# EAGLE design TelTail Lights EP 2v1 (EAGLE 9.6.2)
Assembly variants: PCBA
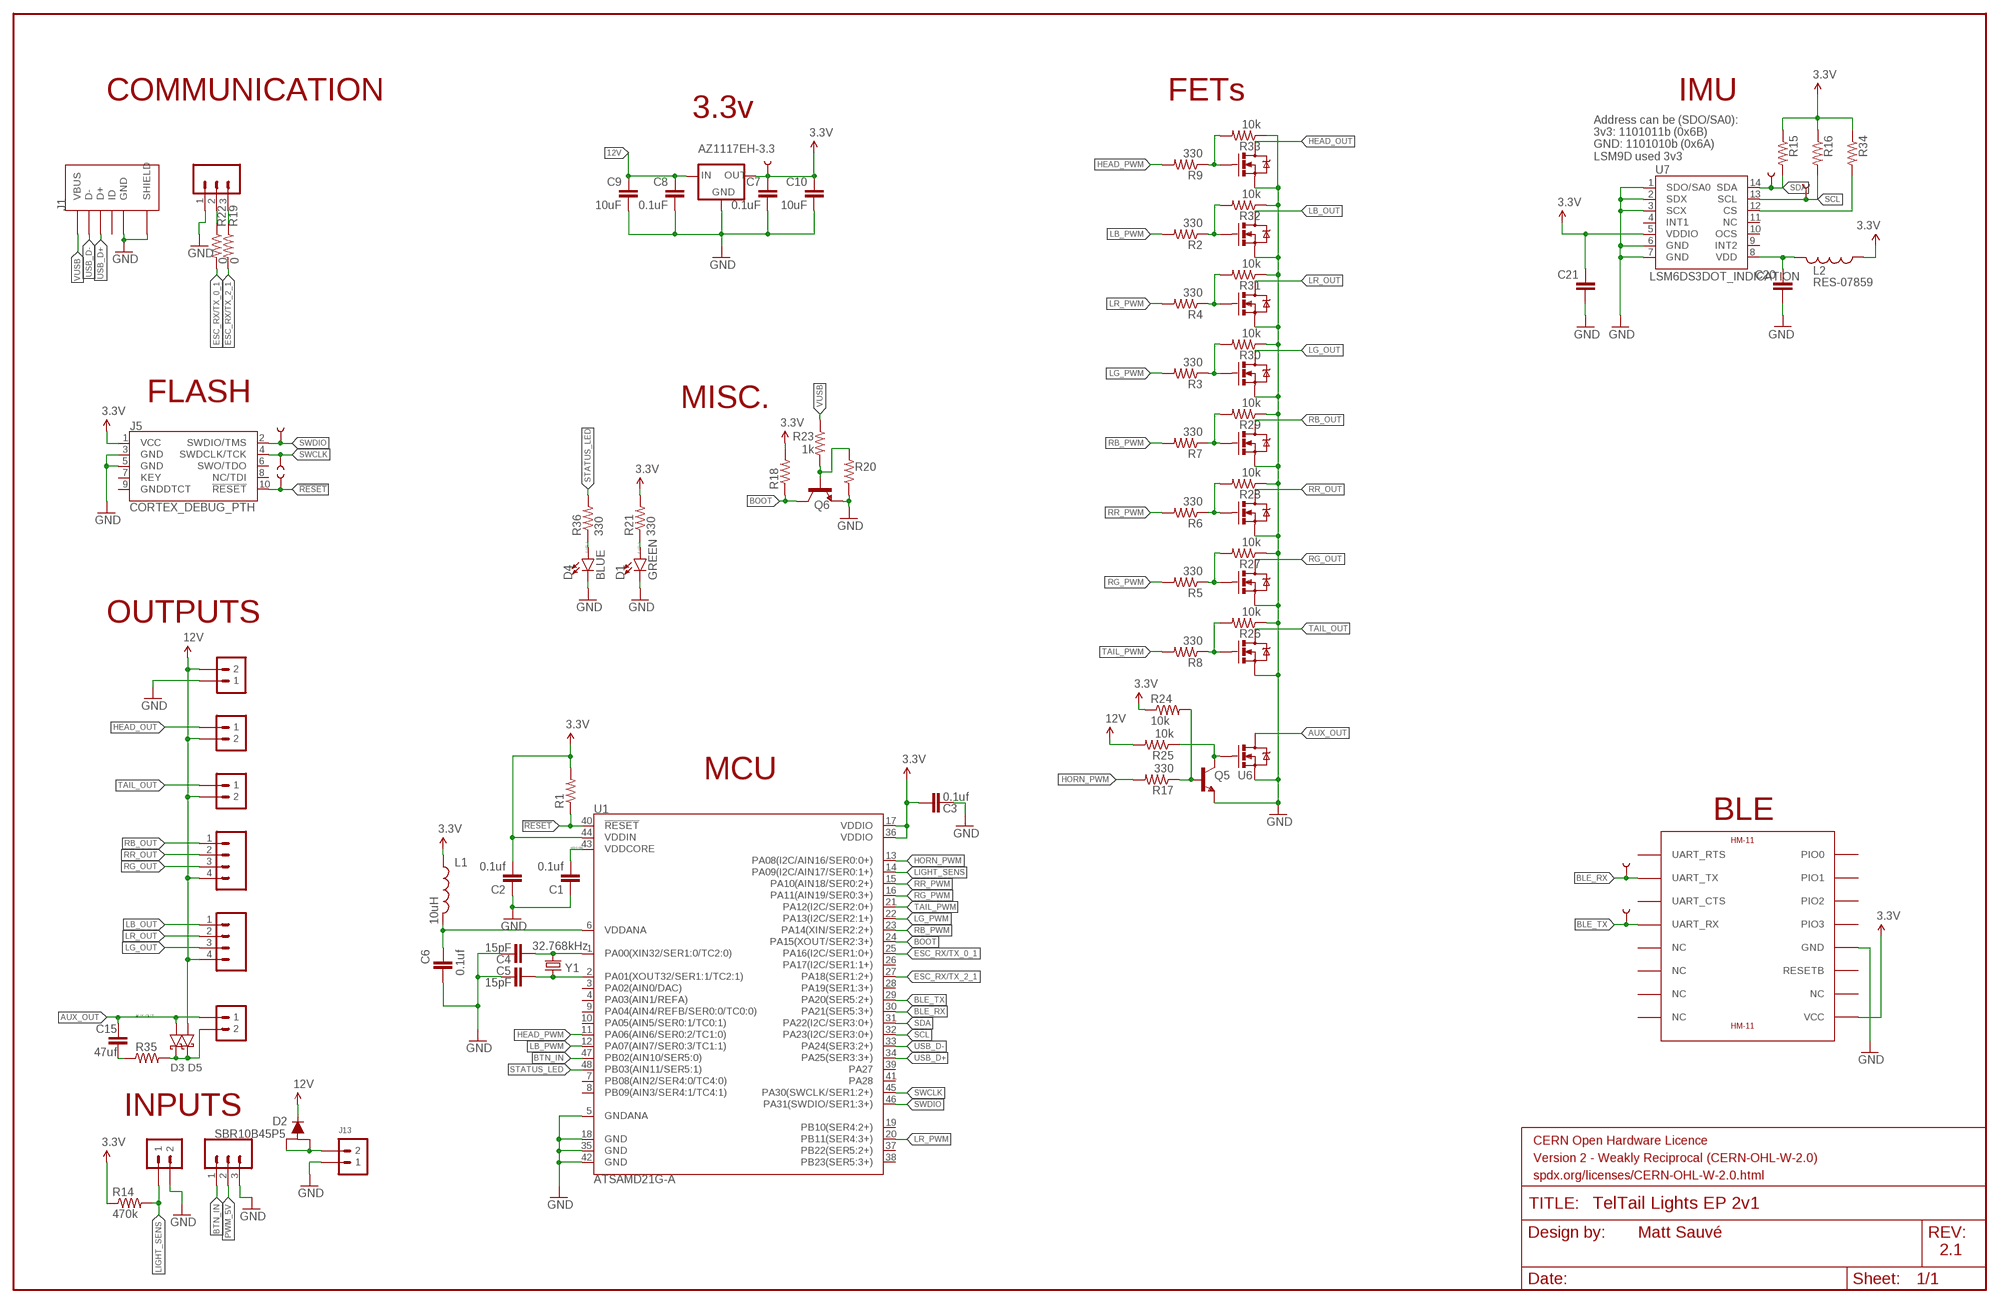
[diagram p0: schematic, sheet 1]

## Parts
C1  0.1uf  CAP0603-CAP  [0603-CAP]
C2  0.1uf  CAP0603-CAP  [0603-CAP]
C3  0.1uf  CAP0603-CAP  [0603-CAP]
C4  15pF  CAP0603-CAP  [0603-CAP]
C5  15pF  CAP0603-CAP  [0603-CAP]
C6  0.1uf  CAP0603-CAP  [0603-CAP]
C7  0.1uF  CAP0603-CAP  [0603-CAP]
C8  0.1uF  CAP0603-CAP  [0603-CAP]
C9  10uF  CAP0603-CAP  [0603-CAP]
C10  10uF  CAP0603-CAP  [0603-CAP]
C15  47uf  CAP1210  [1210-CAP]
C20  0.1uF  CAP0603-CAP  [0603-CAP]
C21  0.1uF  CAP0603-CAP  [0603-CAP]
D1  GREEN  LED0603  [LED-0603-2]
D2  SBR10B45P5  [POWERDI5]
D3  PMEG2010ER  [SOD-123W]
D4  BLUE  LED0603  [LED-0603-2]
D5  PMEG2010ER  [SOD-123W]
FRAME1  FRAME-LEDGER_CERN_WEAK  [CERN_WEAK]
J1  USB3160-XX-XXXX-X-X_REVA  [GCT_USB3160-XX-XXXX-X-X_REVA]
J3  JST_PH_3POS  [JST_PH_3POS]  (not fitted in variant PCBA)
J4  JST_PH_2POS  [JST_PH_2POS]  (not fitted in variant PCBA)
J5  CORTEX_DEBUG_PTH  [2X5-PTH-1.27MM-2]  (not fitted in variant PCBA)
J6  JST_PH_2POS  [JST_PH_2POS]  (not fitted in variant PCBA)
J7  JST_PH_2POS  [JST_PH_2POS]  (not fitted in variant PCBA)
J8  JST_PH_4POS  [JST_PH_4POS]  (not fitted in variant PCBA)
J9  JST_PH_4POS  [JST_PH_4POS]  (not fitted in variant PCBA)
J10  JST_PH_2POS  [JST_PH_2POS]  (not fitted in variant PCBA)
J11  JST_PH_2POS  [JST_PH_2POS]  (not fitted in variant PCBA)
J12  JST_PH_3POS  [JST_PH_3POS]  (not fitted in variant PCBA)
J13  TERM_BLOCK_SPRING_2POS_5MM  [TERM_BLOCK_SPRING_2POS_5MM]  (not fitted in variant PCBA)
L1  10uH  INDUCTOR0603  [0603-IND]
L2  RES-07859  INDUCTOR0603  [0603-IND]
Q1  DUAL_NFET_3.5A  [TSOT26]
Q2  DUAL_NFET_3.5A  [TSOT26]
Q3  DUAL_NFET_3.5A  [TSOT26]
Q4  DUAL_NFET_3.5A  [TSOT26]
Q5  500mA/300V  TRANS_NPN-MMBTA42  [SOT23-3]
Q6  500mA/300V  TRANS_NPN-MMBTA42  [SOT23-3]
R1  10k  RES-0402  [RES-0402]
R2  330  RES-0402  [RES-0402]
R3  330  RES-0402  [RES-0402]
R4  330  RES-0402  [RES-0402]
R5  330  RES-0402  [RES-0402]
R6  330  RES-0402  [RES-0402]
R7  330  RES-0402  [RES-0402]
R8  330  RES-0402  [RES-0402]
R9  330  RES-0402  [RES-0402]
R14  470k  RES-0603  [RES-0603]
R15  10k  RES-0402  [RES-0402]
R16  10k  RES-0402  [RES-0402]
R17  330  RES-0402  [RES-0402]
R18  10k  RES-0402  [RES-0402]
R19  0  RES-0603  [RES-0603]
R20  10k  RES-0402  [RES-0402]
R21  330  RES-0402  [RES-0402]
R22  0  RES-0603  [RES-0603]
R23  1k  RES-0402  [RES-0402]
R24  10k  RES-0402  [RES-0402]
R25  10k  RES-0402  [RES-0402]
R26  10k  RES-0402  [RES-0402]
R27  10k  RES-0402  [RES-0402]
R28  10k  RES-0402  [RES-0402]
R29  10k  RES-0402  [RES-0402]
R30  10k  RES-0402  [RES-0402]
R31  10k  RES-0402  [RES-0402]
R32  10k  RES-0402  [RES-0402]
R33  10k  RES-0402  [RES-0402]
R34  10k  RES-0402  [RES-0402]
R35  100  RESISTOR0805  [0805-RES]
R36  330  RES-0402  [RES-0402]
TP1  1MM_TP  [1MM_TP]  (not fitted in variant PCBA)
TP2  1MM_TP  [1MM_TP]  (not fitted in variant PCBA)
TP3  1MM_TP  [1MM_TP]
TP4  1MM_TP  [1MM_TP]  (not fitted in variant PCBA)
TP5  1MM_TP  [1MM_TP]  (not fitted in variant PCBA)
TP8  1MM_TP  [1MM_TP]  (not fitted in variant PCBA)
TP9  1MM_TP  [1MM_TP]  (not fitted in variant PCBA)
TP10  1MM_TP  [1MM_TP]  (not fitted in variant PCBA)
U1  ATSAMD21G-A  [TQFP-48]
U3  HM-11  [HM-11]  (not fitted in variant PCBA)
U4  AZ1117EH-3.3  [SOT-223]
U6  PSMN8R5-60YS  [SOT669]
U7  LSM6DS3DOT_INDICATION  [LGA14L_DOT_INDICATOR]
Y1  32.768kHz  CRYSTAL-32.768KHZSMD-3.2X1.5  [CRYSTAL-SMD-3.2X1.5MM]

## Nets
3.3V: C2.2 C3.2 C7.1 C10.1 C21.1 J5.1(VCC) L1.1 L2.1 R1.2 R14.1 R15.1 R16.1 R18.2 R21.2 R24.1 R34.1 TP3.P$1 U1.17(VDDIO) U1.36(VDDIO) U1.44(VDDIN) U3.VCC U4.2(OUT) U4.4(OUT) U7.5(VDDIO)
12V: C8.1 C9.1 D2.CATHODE(C) D5.2(ANODE) J4.2 J6.2 J7.2 J8.4 J9.4 R25.2 U4.3(IN)
!RESET: J5.10(!RESET) R1.1 TP10.P$1 U1.40(!RESET!)
AUX_OUT: C15.1 D3.2(ANODE) J10.1 U6.P$1(D) U6.P$2(D)
BLE_RX: TP2.P$1 U1.30(PA21(SER5:3+)) U3.UART_TX
BLE_TX: TP1.P$1 U1.29(PA20(SER5:2+)) U3.UART_RX
BOOT: Q6.3(C) R18.1 U1.24(PA15(XOUT/SER2:3+))
BTN_IN: J12.1 U1.47(PB02(AIN10/SER5:0))
ESC_RX/TX_0_0: J3.2 R22.1
ESC_RX/TX_0_1: R22.2 U1.25(PA16(I2C/SER1:0+))
ESC_RX/TX_2_0: J3.3 R19.1
ESC_RX/TX_2_1: R19.2 U1.27(PA18(SER1:2+))
GND: C1.1 C2.1 C3.1 C4.2 C5.2 C6.2 C7.2 C8.2 C9.2 C10.2 C20.2 C21.2 D1.C D4.C J1.5(GND) J1.6(SHIELD) J1.7(SHIELD) J1.8(SHIELD) J3.1 J4.1 J5.3(GND) J5.5(GND) J11.2 J12.3 J13.P1_1 J13.P1_2 Q1.2(B:S) Q1.5(A:S) Q2.2(B:S) Q2.5(A:S) Q3.2(B:S) Q3.5(A:S) Q4.2(B:S) Q4.5(A:S) Q5.2(E) Q6.2(E) R20.1 R26.1 R27.1 R28.1 R29.1 R30.1 R31.1 R32.1 R33.1 U1.5(GNDANA) U1.18(GND) U1.35(GND) U1.42(GND) U3.GND U4.1(GND) U6.1(S) U6.2(S) U6.3(S) U7.1(SDO/SA0) U7.2(SDX) U7.3(SCX) U7.6(GND) U7.7(GND)
HEAD_OUT: J6.1 Q1.4(B:D)
HEAD_PWM: R9.2 U1.11(PA06(AIN6/SER0:2/TC1:0))
HORN_PWM: R17.2 U1.13(PA08(I2C/AIN16/SER0:0+))
IMU_CS: R34.2 U7.12(CS)
LB_OUT: J9.1 Q1.6(A:D)
LB_PWM: R2.2 U1.12(PA07(AIN7/SER0:3/TC1:1))
LG_OUT: J9.3 Q2.6(A:D)
LG_PWM: R3.2 U1.22(PA13(I2C/SER2:1+))
LIGHT_SENS: J11.1 R14.2 U1.14(PA09(I2C/AIN17/SER0:1+))
LR_OUT: J9.2 Q2.4(B:D)
LR_PWM: R4.2 U1.20(PB11(SER4:3+))
N$1: Q1.1(A:G) R2.1 R32.2
N$2: Q1.3(B:G) R9.1 R33.2
N$3: D3.1(CATHODE) D5.1(CATHODE) J10.2 R35.2
N$4: C6.1 L1.2 U1.6(VDDANA)
N$5: Q2.3(B:G) R4.1 R31.2
N$6: Q2.1(A:G) R3.1 R30.2
N$7: Q3.3(B:G) R7.1 R29.2
N$8: Q3.1(A:G) R6.1 R28.2
N$9: Q4.3(B:G) R5.1 R27.2
N$10: Q4.1(A:G) R8.1 R26.2
N$14: Q5.1(B) R17.1 R24.2
N$16: Q6.1(B) R20.2 R23.2
N$17: C15.2 R35.1
N$19: Q5.3(C) R25.1 U6.4(G)
N$26: C5.1 U1.2(PA01(XOUT32/SER1:1/TC2:1)) Y1.P$1
P_LED_0: D1.A R21.1
PWM_5V: J12.2
RB_OUT: J8.1 Q3.4(B:D)
RB_PWM: R7.2 U1.23(PA14(XIN/SER2:2+))
RG_OUT: J8.3 Q4.4(B:D)
RG_PWM: R5.2 U1.16(PA11(AIN19/SER0:3+))
RR_OUT: J8.2 Q3.6(A:D)
RR_PWM: R6.2 U1.15(PA10(AIN18/SER0:2+))
S_LED_0: D4.A R36.1
SCL: R16.2 TP5.P$1 U1.32(PA23(I2C/SER3:0+)) U7.13(SCL)
SDA: R15.2 TP4.P$1 U1.31(PA22(I2C/SER3:0+)) U7.14(SDA)
STATUS_LED: R36.2 U1.48(PB03(AIN11/SER5:1))
SWCLK: J5.4(SWDCLK/TCK) TP9.P$1 U1.45(PA30(SWCLK/SER1:2+))
SWDIO: J5.2(SWDIO/TMS) TP8.P$1 U1.46(PA31(SWDIO/SER1:3+))
TAIL_OUT: J7.1 Q4.6(A:D)
TAIL_PWM: R8.2 U1.21(PA12(I2C/SER2:0+))
USB_D+: J1.3(D+) U1.34(PA25(SER3:3+))
USB_D-: J1.2(D-) U1.33(PA24(SER3:2+))
VCC: D2.ANODE1(A) D2.ANODE2(A1) J13.P2_1 J13.P2_2
VDD: C20.1 L2.2 U7.8(VDD)
VDDANA: C4.1 U1.1(PA00(XIN32/SER1:0/TC2:0)) Y1.P$2
VDDCORE: C1.2 U1.43(VDDCORE)
VUSB: J1.1(VBUS) R23.1
Unconnected: J1.4(ID) J5.6(SWO/TDO) J5.7(KEY) J5.8(NC/TDI) J5.9(GNDDTCT) U1.3(PA02(AIN0/DAC)) U1.4(PA03(AIN1/REFA)) U1.7(PB08(AIN2/SER4:0/TC4:0)) U1.8(PB09(AIN3/SER4:1/TC4:1)) U1.9(PA04(AIN4/REFB/SER0:0/TC0:0)) U1.10(PA05(AIN5/SER0:1/TC0:1)) U1.19(PB10(SER4:2+)) U1.26(PA17(I2C/SER1:1+)) U1.28(PA19(SER1:3+)) U1.37(PB22(SER5:2+)) U1.38(PB23(SER5:3+)) U1.39(PA27) U1.41(PA28) U3.NC@5(NC) U3.NC@6(NC) U3.NC@7(NC) U3.NC@8(NC) U3.NC@10(NC) U3.PIO0 U3.PIO1 U3.PIO2 U3.PIO3 U3.RESETB U3.UART_CTS U3.UART_RTS U7.4(INT1) U7.9(INT2) U7.10(OCS) U7.11(NC)

## Notes on the sheet
- COMMUNICATION | FETs | IMU
- Address can be (SDO/SA0):
  3v3: 1101011b (0x6B)
  GND: 1101010b (0x6A)
  LSM9D used 3v3
- 3.3v
- FLASH | MISC.
- OUTPUTS
- MCU
- BLE
- INPUTS
- Matt Sauvé
- 2.1

## Library data of the parts
C1-C10 C15 C20 C21 = SAUVE:CAP: Capacitor Standard 0603 ceramic capacitor, and 0.1" leaded capacitor.
D1 D4 = SAUVE:LED: LED (Generic) Standard schematic elements and footprints for 5mm, 3mm, 1206, and 0603 sized LEDs. Generic LEDs with no color specified.
D2 = SAUVE:SBR10B45P5
D3 D5 = SAUVE:PMEG2010ER
FRAME1 = SAUVE:FRAME-LEDGER_CERN_WEAK: Schematic Frame - Ledger Standard 11x14 US Ledger frame
J1 = SAUVE:USB3160-XX-XXXX-X-X_REVA: Micro USB Receptacle, Type B, SMT, Vertical, with Locating Peg, with Through-Hole Shell Stakes; AVAILABILITY: Unavailable; DESCRIPTION: Micro B Skt, Vertical, SMT, 30 , 1.7mm stake, no MEF, peg, T+R+Cap; MF: Global Connector Technology; MP: USB3160-30-0170-0-C; PACKAGE: None; PRICE: None
J3 J12 = SAUVE:JST_PH_3POS
J4 J6 J7 J10 J11 = SAUVE:JST_PH_2POS
J5 = SAUVE:CORTEX_DEBUG: Cortex Debug Connector - 10 pin Supports JTAG debug, Serial Wire debug, and Serial Wire Viewer. PTH and SMD connector options available. General Connector Information <http://infocenter.arm.com/help/topic/com.arm.doc.faqs/attached/13634/cortex_debug_connectors.pdf> Products: PTH Connector <http://www.digikey.com/product-detail/en/cnc-tech/3220-10-0100-00/1175-1627-ND/3883661> -via Digi-Key SparkFun PSoc <https://www.sparkfun.com/products/13229> SparkFun T <https://www.sparkfun.com/products/13810>
J8 J9 = SAUVE:JST_PH_4POS
J13 = SAUVE:TERM_BLOCK_SPRING_2POS_5MM
L1 = SAUVE:INDUCTOR: Inductors Basic Inductor/Choke - 0603 and 1206. Footprints are not proven and vary greatly between part numbers. INDUCTOR POWER 3.3UH 4.0A SMD 0.197" L x 0.197" W x 0.177" H (5.00mm x 5.00mm x 4.50mm); PROD_ID: RES-07859
L2 = SAUVE:INDUCTOR: Inductors Basic Inductor/Choke - 0603 and 1206. Footprints are not proven and vary greatly between part numbers. INDUCTOR POWER 3.3UH 4.0A SMD 0.197" L x 0.197" W x 0.177" H (5.00mm x 5.00mm x 4.50mm)
Q1-Q4 = SAUVE:DUAL_NFET_3.5A
Q5 Q6 = SAUVE:TRANS_NPN: NPN transistor Current controlled devices typically used to amplify current or used as a switch. BC547 - COM-08928 <http://www.sparkfun.com/products/8928> (TO-92 45V 100mA) (1.Collector 2.Base 3.Emitter) 2N3904 - COM-00521 <http://www.sparkfun.com/products/521> (TO-92 40V 200mA) (1.Emitter 2.Base 3.Collector) P2N2222A - COM-12852 <http://www.sparkfun.com/products/12852> (TO-92 40V 600mA) (1.Collector 2.Base 3.Emitter); PROD_ID: TRANS-09116
R1-R9 R15-R18 R20 R21 R23-R34 R36 = SAUVE:RES-0402
R14 R19 R22 = SAUVE:RES-0603
R35 = SAUVE:RESISTOR: Generic Resistor Package
TP1-TP5 TP8-TP10 = SAUVE:1MM_TP
U1 = SAUVE:ATSAMD21G: Atmel SAMD21G SMART ARM-Based Microcontroller The Atmel ® | SMART ™ SAM D21 is a series of low-power microcontrollers using the 32-bit ARM ® Cortex ® -M0+ processor, and ranging from 32- to 64-pins with up to 256KB Flash and 32KB of SRAM. The SAM D21 devices operate at a maximum frequency of 48MHz and reach 2.46 CoreMark/MHz. They are designed for simple and intuitive migration with identical peripheral modules, hex compatible code, identical linear address map and pin compatible migration paths between all devices in the product series. All devices include intelligent and flexible peripherals, Atmel Event System for inter-peripheral signaling, and support for capacitive touch button, slider and wheel user interfaces. Datasheet <https://cdn.sparkfun.com/datasheets/Dev/Arduino/Boards/Atmel-42181-SAM-D21_Datasheet.pdf> SparkFun Products SparkFun SAMD21 Mini Breakout <https://www.sparkfun.com/products/13664> (DEV-13664) SparkFun SAMD21 Dev Breakout <https://www.sparkfun.com/products/13672> (DEV-13672); PROD_ID: IC-13064
U3 = SAUVE:HM-11
U4 = SAUVE:AZ1117EH-3.3
U6 = SAUVE:PSMN8R5-60YS
U7 = SAUVE:LSM6DS3; PROD_ID: IC-12969
Y1 = SAUVE:CRYSTAL-32.768KHZ: 32.768kHz Crystal Frequency: 32.768kHz Frequency Stability: ±20ppm Load Capacitance: 12.5pF (PTH-2X6 & SMD-3.2X1.5), 6pF (SMD-2X6) SparkFun Products: SparkFun BigTime Watch Kit <https://www.sparkfun.com/products/11734> SparkFun nRF52832 Breakout <https://www.sparkfun.com/products/13990> SparkFun Real Time Clock Module <https://www.sparkfun.com/products/12708>; PROD_ID: XTAL-13062

## Board
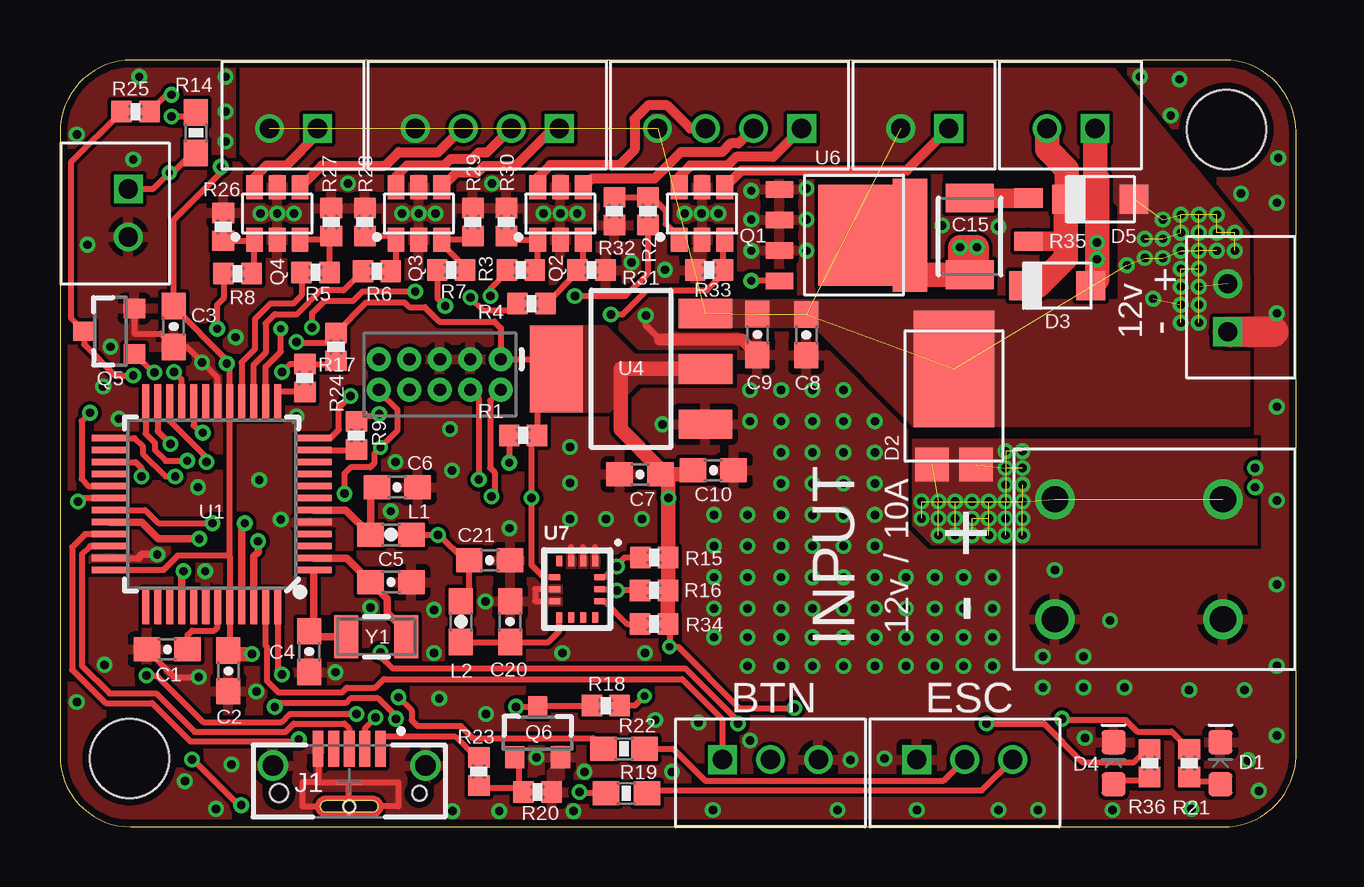
[diagram p1: board, top side]
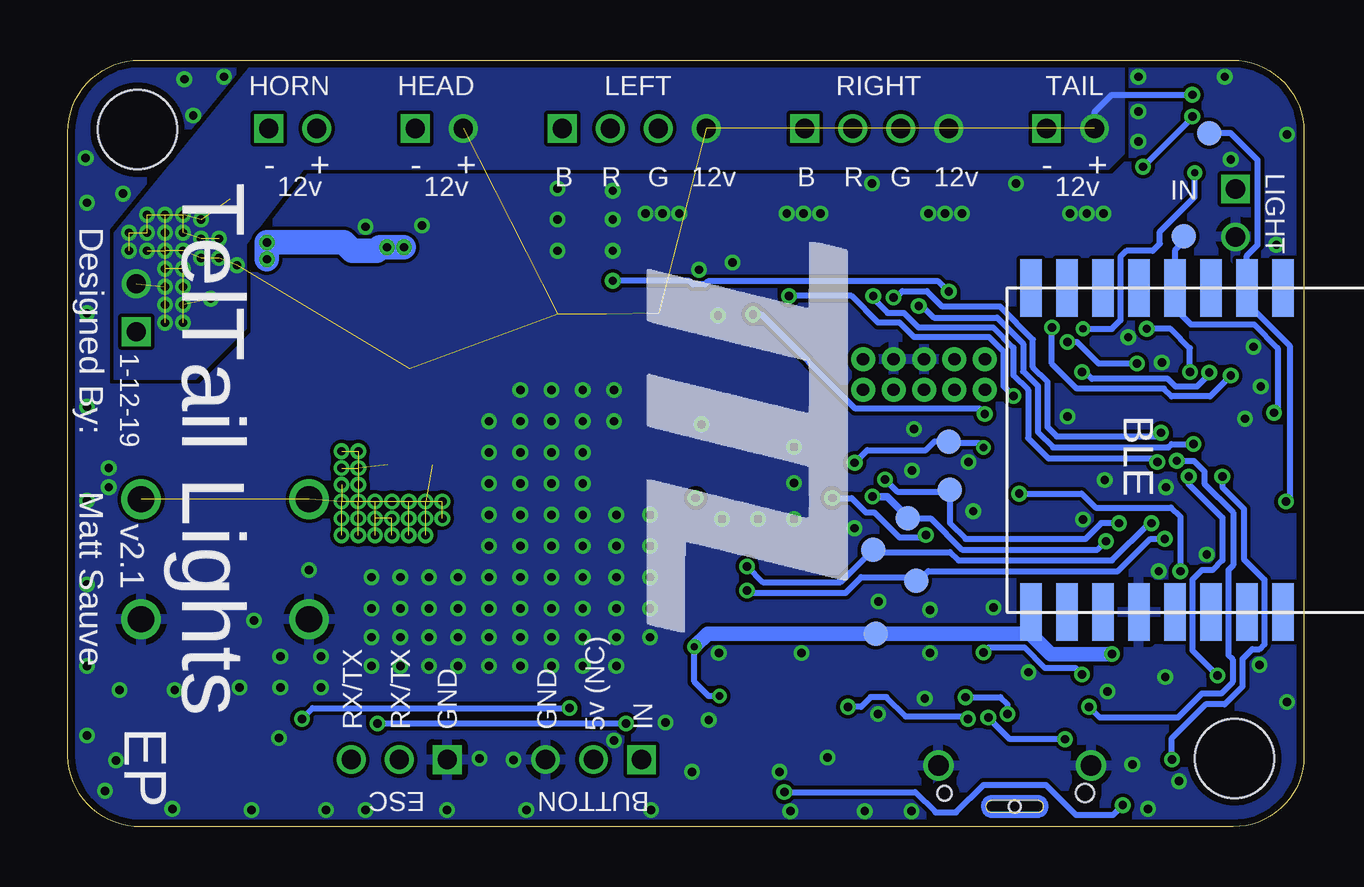
[diagram p2: board, bottom side, seen from below]

Size 51.5 x 31.95 mm. Coordinates in mm from the lower left corner, seen from the top.
Outline: 2.95,0 48.45,0 arc90 51.5,2.95 51.5,28.95 arc90 48.5,31.95 3,31.95 arc90 0,28.95 0,2.95 arc90 2.95,0
Copper layers (1*16): Top 0.035mm / dielectric 1.5mm / Bottom 0.035mm
Design rules "ALLPCB": minimum track width 6mil, minimum drill 12mil, track to track 6mil, track to pad 6mil, pad to pad 6mil, via to via 6mil, smd to smd 6mil, copper to edge 12mil, drill to drill 12mil, minimum pad ring 7mil, minimum via ring 6mil, stop-mask expansion 0mil, vias tented up to drill 0.35mm, thermal gap 10mil

### Footprints (pad centres in the part's own frame; a part is rotated, then mirrored left to right if it is on the bottom)
0603-CAP = smd 1.1 x 1: 1 -0.85,0; 2 0.85,0
1210-CAP = smd 1.2 x 2: 1 -1.6,0; 2 1.6,0
LED-0603-2 = smd 1 x 1: A -0.877,0; C 0.877,0
POWERDI5 = smd 1.4 x 1.39: ANODE1 -2.856,0.92; ANODE2 -2.856,-0.92 | smd 4.86 x 3.36: CATHODE 1.126,0
SOD-123W = smd 1.2 x 1.2: 1 -1.4,0; 2 1.4,0
GCT_USB3160-XX-XXXX-X-X_REVA = smd 0.45 x 1.5: 1 -1.3,-1.35; 2 -0.65,-1.35; 3 0,-1.35; 4 0.65,-1.35; 5 1.3,-1.35 | smd 0.1 x 0.1: 6 0,1.4 | drill 0.85 pad 1.25: 7 3.18,-0.65; 8 -3.18,-0.65 | hole 0.5: 0,1.05 | hole 0.6: -2.925,0.5 | hole 0.75: 2.925,0.5
JST_PH_3POS = drill 0.8 square: 1 -2,0 | drill 0.8: 2 0,0; 3 2,0
JST_PH_2POS = drill 0.8 square: 1 -1.028,0 | drill 0.8: 2 0.972,0
2X5-PTH-1.27MM-2 = drill 0.508 pad 1: 1 -2.54,-0.635; 2 -2.54,0.635; 3 -1.27,-0.635; 4 -1.27,0.635; 5 0,-0.635; 6 0,0.635; 7 1.27,-0.635; 8 1.27,0.635; 9 2.54,-0.635; 10 2.54,0.635
JST_PH_4POS = drill 0.8 square: 1 -3,0 | drill 0.8: 2 -1,0; 3 1,0; 4 3,0
TERM_BLOCK_SPRING_2POS_5MM = drill 1.1: P1_1 -2.5,3.5; P1_2 -2.5,-3.5; P2_1 2.5,3.5; P2_2 2.5,-3.5
0603-IND = smd 1.1 x 1: 1 -0.85,0; 2 0.85,0
TSOT26 = smd 0.7 x 1: 1 -0.95,-1.099; 2 0,-1.099; 3 0.95,-1.099; 4 0.95,1.099; 5 0,1.099; 6 -0.95,1.099
SOT23-3 = smd 0.8 x 0.9: 1 -0.95,-1; 2 0.95,-1; 3 0,1.1
RES-0402 = smd 0.85 x 0.9: 1 -0.58,0; 2 0.58,0
RES-0603 = smd 1.1 x 1: 1 -0.85,0; 2 0.85,0
0805-RES = smd 0.8 x 1.2: 1 -0.9,0; 2 0.9,0
1MM_TP = smd 1.016 x 1.016: P$1 0,0
TQFP-48 = smd 1.5 x 0.28: 1 -4.25,2.75; 2 -4.25,2.25; 3 -4.25,1.75; 4 -4.25,1.25; 5 -4.25,0.75; 6 -4.25,0.25; 7 -4.25,-0.25; 8 -4.25,-0.75; 9 -4.25,-1.25; 10 -4.25,-1.75; 11 -4.25,-2.25; 12 -4.25,-2.75; 25 4.25,-2.75; 26 4.25,-2.25; 27 4.25,-1.75; 28 4.25,-1.25; 29 4.25,-0.75; 30 4.25,-0.25; 31 4.25,0.25; 32 4.25,0.75; 33 4.25,1.25; 34 4.25,1.75; 35 4.25,2.25; 36 4.25,2.75 | smd 0.28 x 1.5: 13 -2.75,-4.25; 14 -2.25,-4.25; 15 -1.75,-4.25; 16 -1.25,-4.25; 17 -0.75,-4.25; 18 -0.25,-4.25; 19 0.25,-4.25; 20 0.75,-4.25; 21 1.25,-4.25; 22 1.75,-4.25; 23 2.25,-4.25; 24 2.75,-4.25; 37 2.75,4.25; 38 2.25,4.25; 39 1.75,4.25; 40 1.25,4.25; 41 0.75,4.25; 42 0.25,4.25; 43 -0.25,4.25; 44 -0.75,4.25; 45 -1.25,4.25; 46 -1.75,4.25; 47 -2.25,4.25; 48 -2.75,4.25
HM-11 = smd 2.4 x 0.9: GND 6.5,0; NC@5 -7,0; NC@6 -7,-1.5; NC@7 -7,-3; NC@8 -7,-4.5; NC@10 6.5,-3; PIO0 6.5,6; PIO1 6.5,4.5; PIO2 6.5,3; PIO3 6.5,1.5; RESETB 6.5,-1.5; UART_CTS -7,3; UART_RTS -7,6; UART_RX -7,1.5; UART_TX -7,4.5; VCC 6.5,-4.5
SOT-223 = smd 1.219 x 2.235: 1 -2.311,-3.099; 2 0,-3.099; 3 2.311,-3.099 | smd 3.6 x 2.2: 4 0,3.099
SOT669 = smd 0.7 x 1.15: 1 -1.905,-1.625; 2 -0.635,-1.625; 3 0.635,-1.625; 4 1.905,-1.625 | smd 4.7 x 1.45: P$1 0,3.82 | smd 4.2 x 3.1: P$2 0,1.55
LGA14L_DOT_INDICATOR = smd 0.45 x 0.25: 1 -1.175,0.75; 2 -1.175,0.25; 3 -1.175,-0.25; 4 -1.175,-0.75; 8 1.175,-0.75; 9 1.175,-0.25; 10 1.175,0.25; 11 1.175,0.75 | smd 0.25 x 0.45: 5 -0.5,-0.925; 6 0,-0.925; 7 0.5,-0.925; 12 0.5,0.925; 13 0,0.925; 14 -0.5,0.925
STAND-OFF = hole 3.302: 0,0
CRYSTAL-SMD-3.2X1.5MM = smd 1 x 1.8: P$1 -1.25,0; P$2 1.25,0

### Placement (x,y rotation side)
C1  4.47,7.39 0 top
C2  7.02,6.5 90 top
C3  4.74,20.85 90 top
C4  10.38,7.3 270 top
C5  13.79,10.2 0 top
C6  14.05,14.15 0 top
C7  24.17,14.68 180 top
C8  31.09,20.5 270 top
C9  29.06,20.51 270 top
C10  27.22,14.85 0 top
C15  37.9,24.6 90 top
C20  18.75,8.55 90 top
C21  17.9,11.1 0 top
D1  48.35,2.65 90 top
D2  37.25,17.95 90 top
D3  41.55,22.55 0 top
D4  43.9,2.65 90 top
D5  43.35,26.15 0 top
FRAME1  -12.1,-16.75 0 top  (outside the outline)
J1  12.05,1.9 180 top
J3  37.7,2.8 0 top
J4  48.65,21.65 90 top
J5  15.83,18.84 180 top
J6  36,29.1 180 top
J7  9.7,29.1 180 top
J8  17.8,29.1 180 top
J9  27.9,29.1 180 top
J10  42.1,29.1 180 top
J11  2.85,25.55 270 top
J12  29.6,2.8 0 top
J13  44.95,11.15 90 top
L1  13.79,12.17 180 top
L2  16.7,8.55 270 top
Q1  26.75,25.55 0 top
Q2  20.85,25.55 0 top
Q3  14.95,25.55 0 top
Q4  9.05,25.55 0 top
Q5  2.1,20.65 90 top
Q6  19.9,3.9 0 top
R1  19.3,16.31 0 top
R2  24.5,25.65 270 top
R3  19.2,23.2 180 top
R4  19.65,21.8 180 top
R5  10.65,23.1 180 top
R6  13.2,23.15 180 top
R7  16.3,23.2 180 top
R8  7.4,23.05 180 top
R9  12.35,16.3 270 top
R14  5.66,28.92 270 top
R15  24.76,11.22 180 top
R16  24.75,9.85 180 top
R17  10.2,18.7 270 top
R18  22.74,5.05 0 top
R19  23.6,1.4 180 top
R20  19.9,1.45 180 top
R21  47.05,2.65 90 top
R22  23.5,3.25 180 top
R23  17.45,2.3 270 top
R24  11.5,20 270 top
R25  3.15,29.8 0 top
R26  6.8,25 270 top
R27  11.3,25.2 270 top
R28  12.7,25.2 270 top
R29  17.2,25.2 270 top
R30  18.6,25.2 270 top
R31  22.15,23.2 180 top
R32  23.1,25.65 90 top
R33  27.05,23.2 0 top
R34  24.75,8.45 180 top
R35  40.35,25.3 270 top
R36  45.4,2.65 90 top
TP1  5,24.6 0 bottom
TP2  3.95,28.9 0 bottom
TP3  17.85,8.05 0 bottom
TP4  17.95,11.55 0 bottom
TP5  16.15,10.25 0 bottom
TP8  16.5,12.85 0 bottom
TP9  14.75,14.05 0 bottom
TP10  14.8,16.05 0 bottom
U1  6.32,13.45 180 top
U3  6.88,15.45 270 bottom
U4  23.79,19.08 90 top
U6  31.6,24.65 270 top
U7  21.55,9.9 270 top
U$4  [STAND-OFF]  2.9,2.85 0 top
U$5  [STAND-OFF]  48.6,29.05 0 top
U$22  [TTL_LARGE]  27.4,24.35 270 bottom
Y1  13.18,7.92 180 top

### Tracks (layer width: path | path; a pad name or v marks a point on that pad's centre or on a via)
3.3V  (via drill 0.3, 0.35)
  Top 0.254: C2.2 7.07,7.4 U1.44 7.07,11.3 | 7.07,11.3 U1.17 7.07,19.18 v6.95,19.3 6.95,19.45 4.74,21.66 C3.2 4.74,25.29 6.7,27.25 v6.7,27.5 | U1.36 4.3,10.7 4.9,11.3 7.07,11.3 | 20.3,19.47 J5.1 18.37,20.78 18.1,21.05 15.8,21.05 15.2,21.65 14.55,21.65 14.35,21.85 12.77,21.85 R24.1 11.07,20.15 9.9,20.15 v9.85,20.2 | L2.1 17.05,9.75 C21.1 16.86,11.1 15.8,12.15 v15.76,12.15 v15.77,12.17 L1.1 | U7.5 20.15,10.4 19.65,10.9 v19.65,13.7 19.63,13.72 19.63,16.06 R1.2 19.88,18.27 U4.4 | v24.35,5.45 23.95,5.05 R18.2 | R34.1 25.4,8.38 v25.4,7.5 25.75,7.5 28.3,4.95 v30.6,4.95 | v41.75,4.5 41.81,4.44 44.41,4.44 44.89,3.96 46.32,3.96 R21.2 | v4.65,29.6 5.49,29.6 R14.1
  Top 0.305: 20.3,19.47 U4.4
  Top 0.61: C2.2 7.17,7.2 v8,7.2 | C7.1 26.2,14.68 C10.1 | C7.1 25.02,14.9 23.36,16.56 23.36,19.08 U4.2 | R34.1 R16.1 R15.1 v25.35,13.7 25.35,14.35 C7.1
  Bottom 0.254: v19.65,13.7 18.84,13.7 18.25,13.1 17.91,13.1 16.86,12.05 15.86,12.05 v15.76,12.15 | U3.VCC 11.38,8.35 | v24.35,5.45 24.8,5.45 25.4,6.05 v25.4,7.5 | v30.6,4.95 41.3,4.95 v41.75,4.5 | v4.65,29.6 4.65,29.55 v6.7,27.5 | v6.95,19.3 8.55,19.3 9.45,20.2 v9.85,20.2
  Bottom 0.61: v8,7.2 10.55,7.2 11.38,8.03 11.38,8.35 11.68,8.05 TP3.P$1 24.85,8.05 v25.4,7.5
  pour Top (no thermals): 19.59,20.88 22.73,20.88 23.92,19.69 28.01,19.69 28.01,18.47 24.07,18.47 22.88,17.28 19.59,17.28
12V  (via drill 0.35)  (35 unrouted)
  Top 0.254: R25.2 4.43,30.5 v4.65,30.5
  Bottom 0.254: v4.65,30.5 8,30.5 8.73,29.77 J7.2
  other vias: 47.45,22.5 46.7,22.5 46.7,21.75 47.45,21.75 47.45,21 46.7,21 47.45,23.25 47.45,24 47.45,24.75 46.7,23.25 46.7,24 46.7,24.75 45.95,23.7 45.2,23.7 46.7,25.5 47.45,25.5 48.2,24.75 48.2,24 48.95,24 48.95,24.75 48.2,25.5 44.45,23.4 45.95,24.5 45.2,24.5 45.95,25.3 45.55,22
  pour Bottom (no thermals): 7.5,28.05 8.15,27.4 41.72,27.4 44.1,24.29 44.1,20.75 46.2,18.65 49.55,18.65 49.55,24.73 43.65,31.95 7.5,31.95
  pour Top (no thermals): 7.5,28.05 8.15,27.4 42.56,27.4 44.1,25.84 44.1,17 49.55,17 49.55,24.74 43.65,31.95 7.5,31.95
  pour Top (no thermals): 35.55,16.7 31.44,20.81 25.8,20.81 25.8,21.97 44.11,21.97 45.09,22.95 49.55,22.95 49.55,16.7
!RESET  (via drill 0.3, 0.35)
  Top 0.254: v11.86,13.88 11.86,14.73 12.11,14.98 12.92,14.98 13.1,15.15 13.1,15.54 v13.35,15.8 14.04,16.5 14.04,17.4 13.29,18.15 J5.10 | R1.1 v18.72,15.17
  Top 0.305: U1.40 5.07,10.47 5.15,10.55 v5.15,10.65
  Bottom 0.254: v5.15,10.65 5.15,12.91 5.54,13.3 8.68,13.3 9.26,13.88 v11.86,13.88 | v18.72,15.17 18.19,15.7 15.75,15.7 15.4,16.05 TP10.P$1 14.75,16 13.55,16 v13.35,15.8
AUX_OUT  (via drill 0.35)
  Top 1.016: J10.1 43.13,27.11 43.21,27.02 v43.21,24.35 43.21,22.81 D3.2 | C15.1 35.42,23 U6.P$1 U6.P$2 | C15.1 37.5,23 v37.5,24.15 v38.2,24.15 38.2,23 C15.1
  Bottom 1.016: v37.5,24.15 v38.2,24.15 38.5,24.15 38.64,24.01 39.66,24.01 40,24.35 v43.21,24.35 v43.21,23.65
BLE_RX  (via drill 0.35)
  Top 0.254: U1.30 0.9,13.7 v0.75,13.55
  Bottom 0.254: TP2.P$1 3.05,28.9 1.93,27.78 1.93,24.25 2.38,23.8 U3.UART_TX 2.38,21.83 0.6,20.05 0.6,13.7 v0.75,13.55
BLE_TX  (via drill 0.35)
  Top 0.254: v1.25,17.25 0.9,16.9 0.9,14.5 1.2,14.2 U1.29
  Bottom 0.254: v1.25,17.25 1.1,17.4 1.1,19.95 2.08,20.93 4.71,20.93 5.38,21.6 U3.UART_RX 5.38,24.02 5,24.4 TP1.P$1
BOOT  (via drill 0.35)
  Top 0.254: U1.24 3.57,16.38 3.95,16 3.95,15.7 4.4,15.25 v5.3,15.25 | R18.1 19.95,5.05 Q6.3 v19,5 | v14,4.5 14,4.6 13.25,5.35 12.1,5.35 11.9,5.15 9.1,5.15 v8.95,5
  Bottom 0.254: v5.3,15.25 4.59,15.25 4.14,14.8 4.14,14.3 2.95,13.1 2.95,10.9 3.15,10.7 3.15,7.15 2.98,6.98 2.98,6.03 3.45,5.55 4.25,5.55 5.25,4.55 8.5,4.55 v8.95,5 | v14,4.5 14.1,4.6 16.6,4.6 17.4,5.4 18.05,5.4 18.45,5 v19,5
BTN_IN
  Top 0.254: U1.47 8.57,7.55 8.62,7.5 8.62,6.08 9.1,5.6 11.75,5.6 11.95,5.8 13.14,5.8 13.49,6.15 25.92,6.15 27.6,4.47 J12.1
ESC_RX/TX_0_0
  Top 0.254: R22.1 25.55,3.25 26.88,1.92 36.82,1.92 J3.2
ESC_RX/TX_0_1  (via drill 0.35)
  Top 0.254: U1.25 3.1,16.2 3.45,15.85 3.45,15.55 4.4,14.6 v4.8,14.6 | v3.6,6.3 4.04,6.3 5.98,4.36 9.23,4.36 9.57,4.71 v12.34,4.71 v12.35,4.7 | v14.1,5.4 14.65,4.85 14.65,4.45 14.9,4.2 16.7,4.2 17.2,3.7 22.2,3.7 R22.2
  Bottom 0.254: v4.8,14.6 4.8,14.28 3.4,12.88 3.4,11.1 3.8,10.7 4.25,10.7 4.65,10.3 4.65,7.35 v3.6,6.3 | v12.35,4.7 12.35,5.1 12.65,5.4 v14.1,5.4
ESC_RX/TX_2_0
  Top 0.254: R19.1 24.56,1.51 38.41,1.51 J3.3
ESC_RX/TX_2_1  (via drill 0.35)
  Top 0.254: U1.27 3.15,15.2 3.4,14.95 v3.4,14.6 | R19.2 21.7,1.4 v21.65,1.45 | v7.55,0.9 7.45,0.9 5.55,2.8 v5.5,2.8
  Bottom 0.254: v21.65,1.45 16.2,1.45 15.35,0.6 14.5,0.6 13.35,1.75 10.75,1.75 9.5,0.5 7.95,0.5 v7.55,0.9 | v5.5,2.8 5.5,3.7 4.1,5.1 3.3,5.1 2.55,5.85 2.55,7 2.15,7.4 1.85,7.4 1.65,7.6 1.65,10.3 2.5,11.15 2.5,13.25 3.4,14.15 v3.4,14.6
GND  (via drill 0.35)
  Top 0.076: J1.6 13.05,0.5 arc90 13.4,0.85
  Top 0.254: U1.35 3.25,11.2 | U7.7 19.8,9.4 19.8,9.9 U7.6 | U7.3 21.3,11.65 | 21.8,11.65 U7.2 | U7.1 22.3,11.65 | J1.5 10.75,1.85 | 10.7,0.85 10.1,0.85 10.1,1.85 10.75,1.85 | 12,1.85 12,1.25 | 10.75,1.85 12,1.85 | 12,1.85 14.1,1.85 14.1,0.85 13.4,0.85 | C1.1 4.77,6.24 v5.78,6.24 | v24.41,21.31 24.41,20.89 25,20.3 | Q5.2 3.1,20.55 4.19,20.55 C3.1 5.27,20 v5.92,19.35 6.57,18.7 U1.18
  Top 0.305: 3.25,11.2 3.4,11.35 v4.05,11.35
  Top 0.508: C9.2 28.42,20.3 25,20.3
  Top 1.27: J4.1 50.56,20.62
  other vias: 0.7,5.2 6.05,10.65 9.2,12.8 24.25,12.82 6.9,28.55 14.25,25.55 45,31.25 46.65,31.15 50.7,26 50.7,21.4 50.7,17.5 50.7,13.6 50.7,10.1 50.7,6.7 40.75,0.7 6.9,29.8 6.5,0.75 14.95,25.55 15.65,25.55 21.55,25.55 20.15,25.55 20.85,25.55 9.05,25.55 8.35,25.55 9.75,25.55 16.35,0.65 18.3,0.65 39.1,0.7 2.45,17 49.95,1.5 50.7,3.8 47.15,0.75 43.85,0.7 3.3,31.25 0.7,28.85 1.8,18.35 8.3,14.45 21.85,2.29 24.8,4.45 26.6,4.35 34.35,2.85 32.94,2.79 21.4,0.65 27.2,0.7 32.4,0.7 35.7,0.7 13.98,15.2 16.25,16.57 46.28,29.64 49.21,26.38 49.5,2.77 50.76,27.87 49.8,14.15 49.8,14.95 15.58,9.04 18.73,12.44 26.73,25.55 27.43,25.55 26.03,25.55 15.58,7.24 13.78,13.15 20.93,7.24 11.48,6.44 8.18,5.64 19.85,2.89 17.75,4.7 15.8,5.35 7.15,2.6 1.85,6.75 25.5,2.29 24.38,7.24 28.75,3.6 5.2,1.9 16.33,14.85 25.1,16.77 22.75,12.82 21.25,12.82 21.25,14.32 21.25,15.82 12.93,9.14 36.75,25.05 39.1,25 28.8,24 28.8,25.3 28.8,26.5 31.1,24 31.1,25.3 31.1,26.6 18,26.8 23.81,23.51 25.21,23.21 5.75,14.15 12,26.8 7.32,20.4 9.85,17.1 42.7,3.7 2.1,20 6.9,31.25 3.05,27.8 17.73,9.39 1.15,24.25 30.05,18.2 31.35,18.2 32.65,18.2 30.05,16.9 31.35,16.9 32.65,16.9 33.95,16.9 28.75,18.2 28.75,16.9 30.05,15.6 31.35,15.6 32.65,15.6 33.95,15.6 30.05,14.3 30.05,13 28.65,13 30.05,11.7 30.05,10.4 30.05,9.1 30.05,7.9 30.05,6.7 28.65,6.7 28.65,7.9 28.65,9.1 28.65,10.4 28.65,11.7 31.35,14.3 31.35,13 31.35,11.7 31.35,10.4 31.35,9.1 31.35,7.9 31.35,6.7 32.65,14.3 32.65,13 32.65,11.7 32.65,10.4 32.65,9.1 32.65,7.9 32.65,6.7 33.95,14.3 33.95,13 33.95,11.7 33.95,10.4 33.95,9.1 33.95,7.9 33.95,6.7 35.25,10.4 35.25,9.1 35.25,7.9 35.25,6.7 36.45,10.4 36.45,9.1 36.45,7.9 36.45,6.7 37.65,10.4 37.65,9.1 37.65,7.9 37.65,6.7 38.85,10.4 38.85,9.1 38.85,7.9 38.85,6.7 27.25,7.9 27.25,9.1 27.25,10.4 27.25,11.7 27.25,13 40.95,5.8 42.65,5.8 44.35,5.8 47.05,5.7 49.35,5.7 42.65,7.1 40.95,7.1 43.75,8.6 41.45,10.7
  pour Bottom (rank 6): 51.5,28.95 51.5,2.95 arc-90 48.5,-0.05 3,-0.05 arc-90 0,2.95 0,28.95 arc-90 3,31.95 48.5,31.95 arc-90
  pour Top (rank 6): 51.5,28.95 51.5,2.93 arc-90 48.5,-0.07 3.03,-0.07 arc-90 0.03,2.93 0,28.95 arc-90 3,31.95 48.5,31.95 arc-90
HEAD_OUT
  Top 0.406: Q1.4 28.41,27.36 35.28,27.36 J6.1
HEAD_PWM
  Top 0.254: U1.11 12.33,15.7 R9.2
HORN_PWM
  Top 0.254: R17.2 9.07,18.12 U1.13
IMU_CS
  Top 0.254: U7.12 22.69,9.4 23.64,8.45 R34.2
LB_OUT
  Top 0.406: J9.1 29.71,27.91 28.18,27.91 27.81,27.55 26.25,27.55 25.8,27.1 Q1.6
LB_PWM  (via drill 0.35)
  Top 0.254: U1.12 11.27,16.2 11.62,16.55 11.62,17.47 v12.1,17.95 | v21.45,22.12 23.57,22.12 24.5,23.05 R2.2
  Bottom 0.254: v12.1,17.95 12.51,18.36 12.51,19.8 13.12,20.4 16.25,20.4 16.85,21.01 17.74,21.01 18.85,22.12 v21.45,22.12
LG_OUT
  Top 0.406: J9.3 26.25,29.1 25.3,30.06 24.5,30.06 23.94,29.5 23.94,28.21 23.3,27.57 20.42,27.57 19.9,27.05 Q2.6
LG_PWM  (via drill 0.35)
  Top 0.254: R3.2 18.62,23.1 17.94,22.42 v17.94,22.12 | U1.22 4.57,16.91 6.11,15.38 v6.11,15.2
  Bottom 0.254: v17.94,22.12 17.94,22.02 17.34,21.42 16.67,21.42 16.06,20.81 12.95,20.81 12.1,19.97 12.1,18.81 11.49,18.2 11.49,16.19 10.65,15.35 6.26,15.35 v6.11,15.2
LIGHT_SENS  (via drill 0.3)
  Top 0.254: U1.14 8.57,19.17 9.2,19.8 v9.2,20.75 | J11.1 3.88,26.58 v4.55,27.25 4.7,27.25 5.52,28.07 R14.2
  Bottom 0.254: v9.2,20.75 8,20.75 7.65,21.1 7.65,23.75 7.4,24 6.3,24 6,24.3 6,24.8 4.55,26.25 v4.55,27.25
LR_OUT
  Top 0.406: J9.2 28.27,28.47 27.94,28.47 27.58,28.11 25.87,28.11 24.77,27.01 22.16,27.01 Q2.4
LR_PWM  (via drill 0.35)
  Top 0.254: v17.1,22.05 17.65,21.5 18.77,21.5 R4.2 | U1.20 5.57,16.73 5.88,16.42 v5.95,16.42
  Bottom 0.254: v17.1,22.05 17,22.05 16.73,22.32 15.71,22.32 15.06,21.67 12.66,21.67 11.29,20.3 11.29,19.15 10.68,18.54 10.68,16.65 10.3,16.27 6.1,16.27 v5.95,16.42
N$1
  Top 0.254: R32.2 R2.1 24.67,26.23 25.23,25.67 25.23,25.12 25.8,24.55 Q1.1
N$2  (via drill 0.35)
  Top 0.254: R9.1 12.57,17.1 13.2,17.1 v13.3,17.2 | v22.95,21.35 23.45,21.35 24.45,22.35 26.95,22.35 27.63,23.03 R33.2 27.63,24.38 Q1.3
  Bottom 0.254: v13.3,17.2 13.53,17.43 18.69,17.43 22.62,21.35 v22.95,21.35
N$3
  Top 0.813: R35.2 41.55,24.4 41.95,24.8 D5.1
  Top 1.016: J10.2 41.13,28.22 41.95,27.4 D5.1 41.9,26.1 41.9,23.68 40.77,22.55 D3.1
N$4
  Top 0.305: U1.6 11.91,13.2 L1.2 12.95,13.9 C6.1
N$5
  Top 0.254: R4.1 20.25,21.8 21.57,23.12 R31.2 21.8,23.43 Q2.3
N$6
  Top 0.254: R3.1 19.9,23.32 Q2.1 18.77,24.45 R30.2
N$7
  Top 0.254: R29.2 17.03,24.45 Q3.3 15.9,24.29 16.92,23.27 16.92,23.24 R7.1
N$8
  Top 0.254: R28.2 13.83,24.62 Q3.1 14,23.37 R6.1
N$9
  Top 0.254: Q4.3 11.13,24.45 R27.2 11.23,24.55 R5.1
N$10
  Top 0.254: R8.1 8.1,23.17 Q4.1 8.07,24.42 R26.2
N$14  (via drill 0.35)
  Top 0.254: Q5.1 3.87,18.93 v3.94,18.93 | v9.25,18.95 9.58,19.28 R17.1 11.36,19.28 R24.2
  Bottom 0.254: v3.94,18.93 3.94,18.86 4.46,18.34 5.34,18.34 5.67,18.67 8.83,18.67 9.12,18.95 v9.25,18.95
N$16
  Top 0.254: Q6.1 19.12,2.73 19.12,1.65 R20.2 19.17,1.6 17.57,1.6 R23.2
N$17
  Top 0.813: R35.1 C15.2
N$19  (via drill 0.35)
  Top 0.254: R25.1 0.45,27.68 0.45,21.2 Q5.3 1,20.11 2.31,18.8 v3.05,18.8 | U6.4 v28.8,22.75 | v10.5,20.8 10.5,21.4 11,21.9 12.2,21.9 12.6,22.3 v14.8,22.3
  Bottom 0.254: v3.05,18.8 3.91,17.94 5.51,17.94 5.83,18.26 9.46,18.26 10.5,19.3 v10.5,20.8 | v28.8,22.75 25.61,22.75 25.46,22.6 24.96,22.6 24.84,22.73 15.23,22.73 v14.8,22.3
N$26
  Top 0.305: Y1.P$1 14.43,8.12 13.64,8.91 13.64,9.5 C5.1 11.94,11.2 U1.2
P_LED_0
  Top 0.254: R21.1 47.25,1.87 48.25,1.87 D1.A
RB_OUT
  Top 0.406: J8.1 20.55,29.1 18.98,27.53 17.66,27.53 17.38,27.25 16.5,27.25 Q3.4
RB_PWM  (via drill 0.35)
  Top 0.254: R7.2 15.72,22.03 v16.05,21.7 | v4.61,15.95 4.07,16.49 U1.23
  Bottom 0.254: v16.05,21.7 15.9,21.7 15.42,21.22 12.78,21.22 11.7,20.13 11.7,18.98 11.09,18.37 11.09,16.45 10.45,15.81 5.65,15.81 5.51,15.95 v4.61,15.95
RG_OUT
  Top 0.406: Q4.4 10.9,27.55 13.55,27.55 14.11,28.11 15.77,28.11 16.76,29.1 J8.3
RG_PWM
  Top 0.254: R5.2 10.07,22.15 9.72,21.8 8.77,21.8 8.12,21.15 8.12,19.9 7.57,19.35 U1.16
RR_OUT
  Top 0.406: J8.2 17.79,28.09 17.43,28.09 17.15,27.81 16.26,27.81 16,27.55 14.45,27.55 14,27.1 Q3.6
RR_PWM
  Top 0.254: U1.15 8.07,19.25 8.57,19.75 8.57,20.98 8.95,21.36 9.88,21.36 10.87,22.35 11.82,22.35 R6.2
S_LED_0
  Top 0.254: R36.1 45.27,1.94 44.06,1.94 D4.A
SCL  (via drill 0.35)
  Top 0.254: U7.13 23.15,9.9 v23.2,9.85 R16.2
  Top 0.305: v5.8,12 4.1,12 3.4,12.7 U1.32
  Bottom 0.254: v5.8,12 6.4,12 7.75,10.65 15.65,10.65 16.05,10.25 TP5.P$1 16.3,10.4 18.45,10.4 19.1,9.75 23.1,9.75 v23.2,9.85
SDA  (via drill 0.35)
  Top 0.254: U1.31 3.55,13.2 4.1,12.65 v6.35,12.65 | U7.14 22.69,10.4 23.14,10.85 v23.2,10.85 23.2,10.9 23.52,11.22 R15.2
  Bottom 0.254: v6.35,12.65 6.45,12.65 8,11.1 14.4,11.1 14.75,11.45 17.85,11.45 TP4.P$1 19.3,10.2 22.55,10.2 v23.2,10.85
STATUS_LED  (via drill 0.35)
  Top 0.254: R36.2 45.29,3.23 44.76,2.7 42.6,2.7 41,4.3 v38.6,4.3 | U1.48 9.07,6.53 v9.25,6.35 | v13.35,7.27 13.35,7.12 13.87,6.6 26.05,6.6 28.25,4.4 v28.25,4.3
  Bottom 0.254: v9.25,6.35 9.52,6.62 10.79,6.62 11.64,7.47 13.15,7.47 v13.35,7.27 | v28.25,4.3 v38.6,4.3
SWCLK  (via drill 0.35)
  Top 0.254: v17.45,14.47 17.45,17.86 J5.4
  Top 0.305: U1.45 7.57,12.52 v7.7,12.65
  Bottom 0.254: v17.45,14.47 16.95,13.97 14.83,13.97 TP9.P$1 14.75,12.65 14.1,12 9.1,12 8.45,12.65 v7.7,12.65
SWDIO  (via drill 0.35)
  Top 0.254: J5.2 17.92,17.75 17.92,14.96 18.11,14.77 18.11,13.89 v17.98,13.76
  Top 0.305: v8.25,11.9 8.25,11.45 8.07,11.27 U1.46
  Bottom 0.254: v8.25,11.9 8.6,11.55 14.25,11.55 15.55,12.85 TP8.P$1
  Bottom 0.305: TP8.P$1 16.5,12.9 17.36,13.76 v17.98,13.76
TAIL_OUT
  Top 0.406: J7.1 10.73,28.85 9.43,27.55 8.6,27.55 8.1,27.05 Q4.6
TAIL_PWM  (via drill 0.35)
  Top 0.254: U1.21 5.07,18.63 v4.75,18.95 | R8.2 6.82,22.02 6.55,21.75 v6.55,20.75
  Bottom 0.254: v4.75,18.95 4.75,19.95 5.55,20.75 v6.55,20.75
USB_D+
  Top 0.254: U1.34 1.25,11.7 0.91,11.36 0.91,6.71 2.07,5.56 4.01,5.56 5.61,3.96 9.4,3.96 9.74,4.3 11.85,4.3 12.05,4.1 J1.3
USB_D-  (via drill 0.35)
  Top 0.254: U1.33 1.05,12.2 0.51,11.66 0.51,6.54 1.9,5.15 3.84,5.15 5.44,3.55 9.85,3.55 v9.95,3.65 | v13.15,4.55 12.7,4.1 J1.2
  Bottom 0.254: v9.95,3.65 12.25,3.65 v13.15,4.55
VCC  (via drill 0.35)  (29 unrouted)
  other vias: 37.3,13.55 38,13.55 38.7,13.55 39.4,14.25 39.4,14.95 39.4,15.65 39.4,13.55 38.7,12.85 38,12.85 38.7,12.15 39.4,12.85 39.4,12.15 40.1,15.65 40.1,14.95 40.1,14.25 40.1,13.55 40.1,12.85 40.1,12.15 36.6,13.55 35.9,13.55 35.9,12.85 36.6,12.85 36.6,12.15 37.3,12.85 37.3,12.15 38,12.15
  pour Top (no thermals): 35.55,16.15 49.85,16.15 49.85,11.75 36.35,11.75 35.55,12.55
VDD
  Top 0.254: L2.2 C20.1 20.35,7.7 20.8,8.15 U7.8
VDDANA
  Top 0.305: Y1.P$2 11.3,7.92 10.61,7.92 C4.1 10.57,8.34 U1.1
VDDCORE
  Top 0.254: C1.2 5.32,7.99 5.5,8.17 6.42,8.17 6.57,8.32 U1.43
VUSB
  Top 0.254: J1.1 13.35,3.75 16.48,3.75 17.35,2.88 R23.1

### Text on the board
tPlace: + | - | 12v | 10A | + | INPUT | / | 12v | - | BTN | ESC
bPlace: TAIL | RIGHT | LEFT | HEAD | HORN | + | - | 12v | G | R | B | 12v | G | R | B | + | - | + | - | LIGHT | IN | 12v | 12v | 12v | Designed By: | 1-12-19 | BLE | TelTail Lights | Matt Sauve | v2.1 | IN | 5v (NC) | GND | GND | RX/TX | RX/TX | EP | BUTTON | ESC